# EAGLE design KMO_IO_MV1_3 (EAGLE 9.3.2)

## Sheet 1 of 2
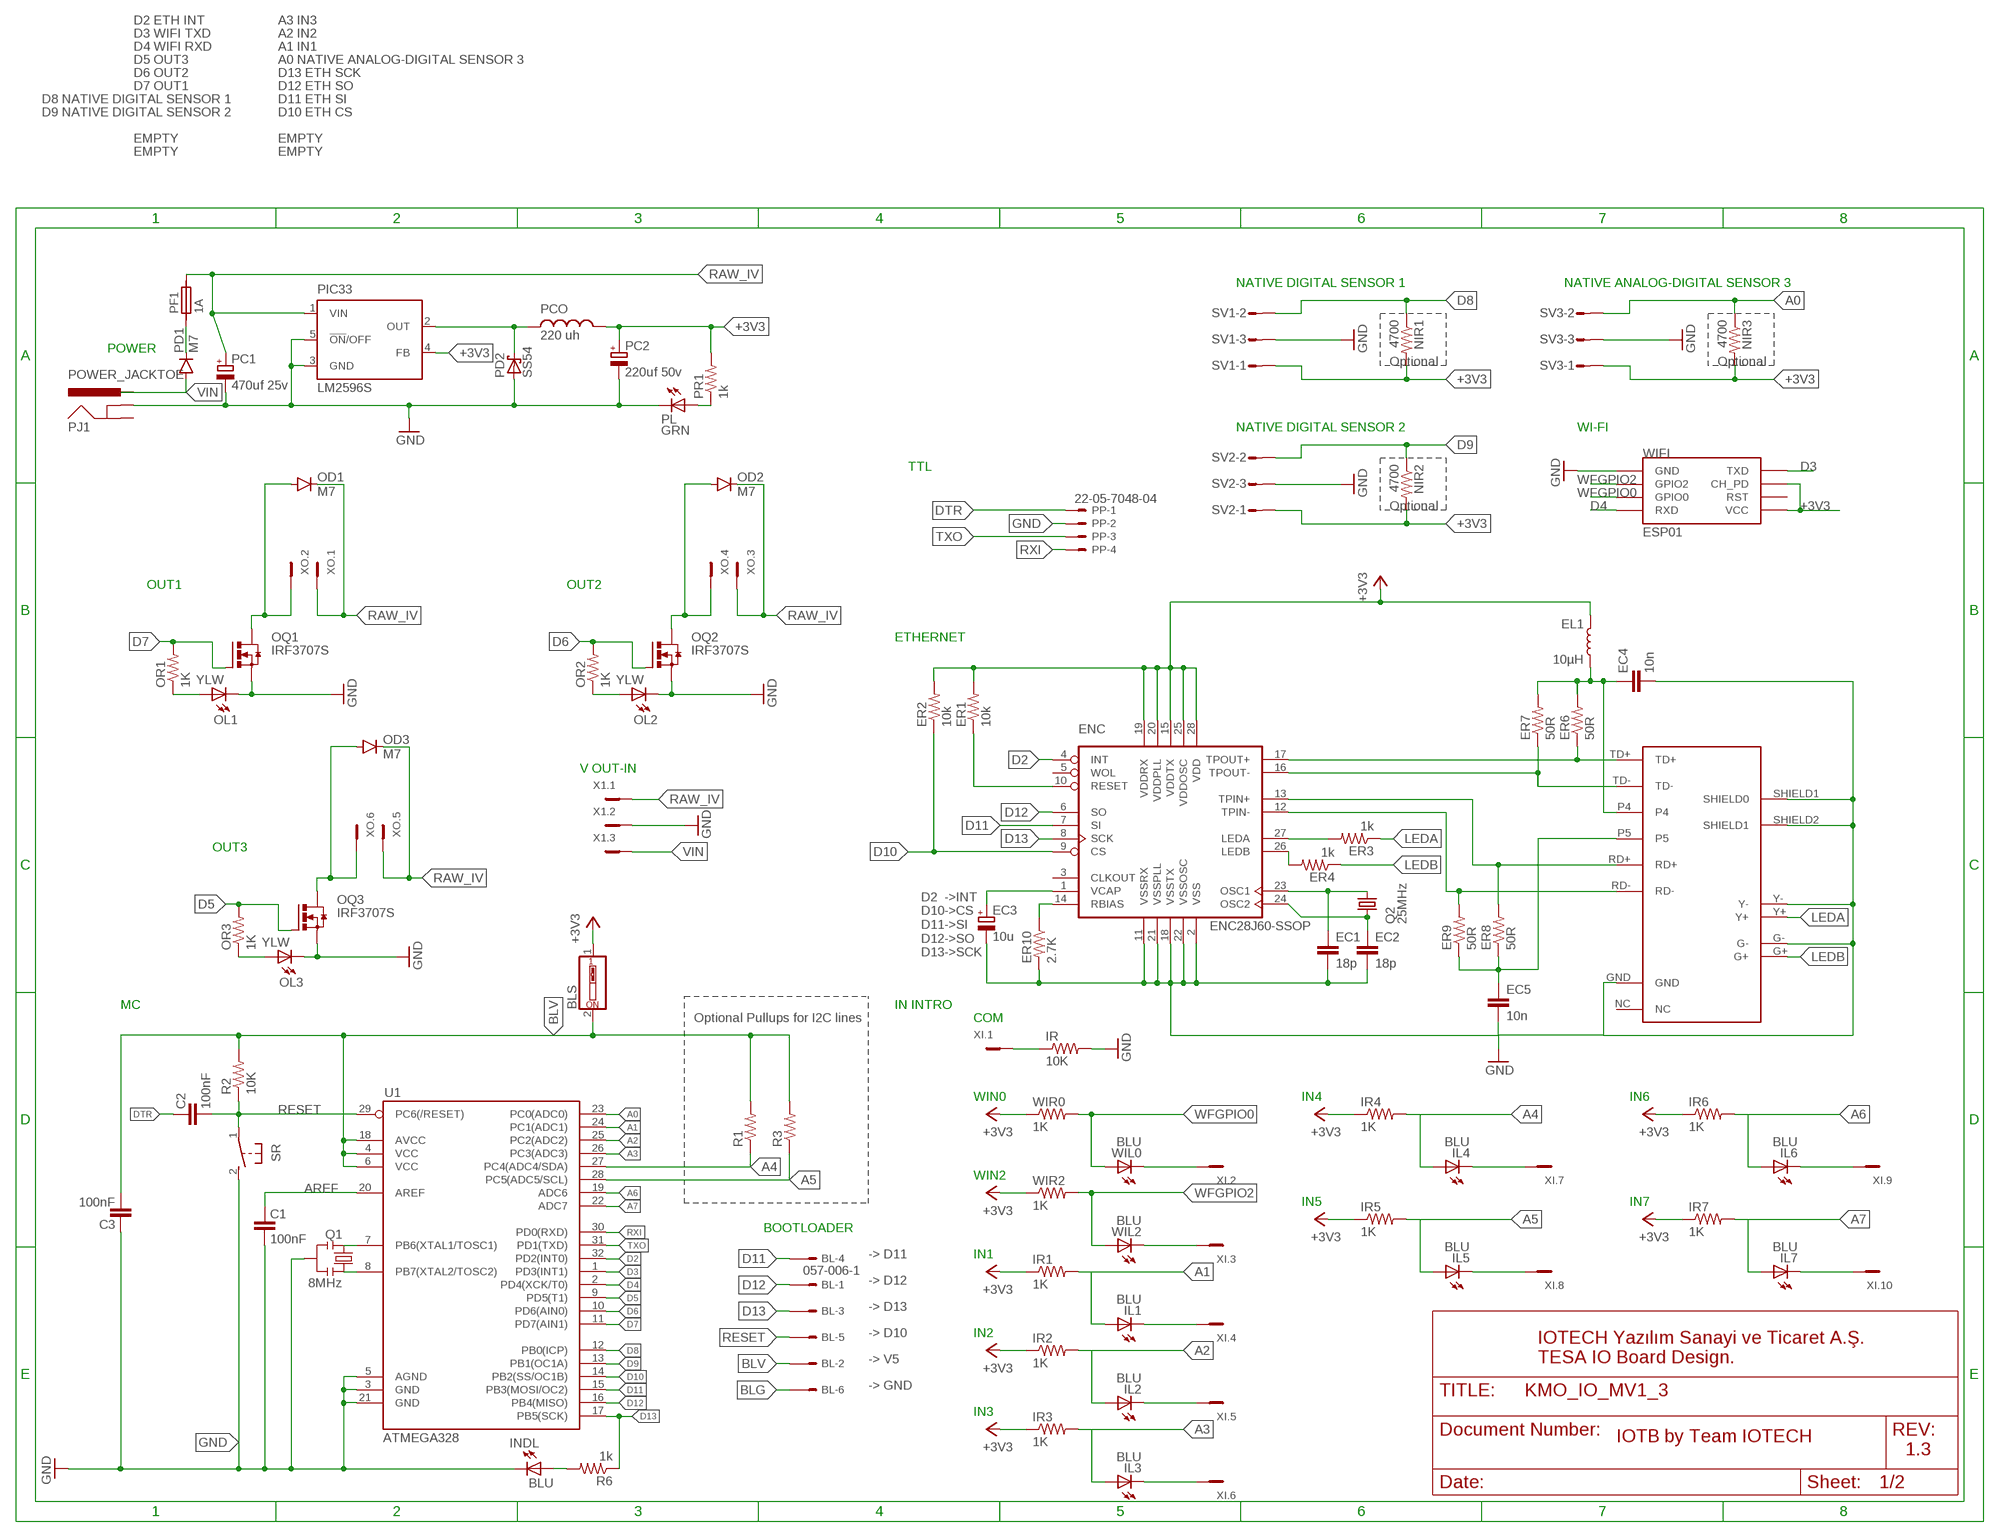
[diagram p0: schematic, sheet 1]

### Parts
BL  057-006-1  [057-006-1]
BLS  SW_DIP-1  [EDG-01]
C1  100nF  CAP0805  [0805]
C2  100nF  CAP0805  [0805]
C3  100nF  CAP0805  [0805]
EC1  18p  CAP0805  [0805]
EC2  18p  CAP0805  [0805]
EC3  10u  CPOL-EUCT3216  [CT3216]
EC4  10n  CAP0805  [0805]
EC5  10n  CAP0805  [0805]
EL1  10µH  INDUCTOR-0805-3.3UH  [0805]
ENC  ENC28J60-SSOP  [SSOP28]
ER1  10k  RESISTOR0805-RES  [0805]
ER2  10k  RESISTOR0805-RES  [0805]
ER3  1k  RESISTOR0805-RES  [0805]
ER4  1k  RESISTOR0805-RES  [0805]
ER6  50R  RESISTOR0805-RES  [0805]
ER7  50R  RESISTOR0805-RES  [0805]
ER8  50R  RESISTOR0805-RES  [0805]
ER9  50R  RESISTOR0805-RES  [0805]
ER10  2.7K  RESISTOR0805-RES  [0805]
IL1  BLU  LEDCHIP-LED0805  [CHIP-LED0805]
IL2  BLU  LEDCHIP-LED0805  [CHIP-LED0805]
IL3  BLU  LEDCHIP-LED0805  [CHIP-LED0805]
IL4  BLU  LEDCHIP-LED0805  [CHIP-LED0805]
IL5  BLU  LEDCHIP-LED0805  [CHIP-LED0805]
IL6  BLU  LEDCHIP-LED0805  [CHIP-LED0805]
IL7  BLU  LEDCHIP-LED0805  [CHIP-LED0805]
INDL  BLU  LEDCHIP-LED0805  [CHIP-LED0805]
IR  10K  RESISTOR0805-RES  [0805]
IR1  1K  RESISTOR0805-RES  [0805]
IR2  1K  RESISTOR0805-RES  [0805]
IR3  1K  RESISTOR0805-RES  [0805]
IR4  1K  RESISTOR0805-RES  [0805]
IR5  1K  RESISTOR0805-RES  [0805]
IR6  1K  RESISTOR0805-RES  [0805]
IR7  1K  RESISTOR0805-RES  [0805]
NIR1  4700  RESISTOR0805-RES  [0805]
NIR2  4700  RESISTOR0805-RES  [0805]
NIR3  4700  RESISTOR0805-RES  [0805]
OD1  M7  DIODESMA  [SMA-DIODE]
OD2  M7  DIODESMA  [SMA-DIODE]
OD3  M7  DIODESMA  [SMA-DIODE]
OL1  YLW  LEDCHIP-LED0805  [CHIP-LED0805]
OL2  YLW  LEDCHIP-LED0805  [CHIP-LED0805]
OL3  YLW  LEDCHIP-LED0805  [CHIP-LED0805]
OQ1  IRF3707S  IRF3704S  [D2PACK]
OQ2  IRF3707S  IRF3704S  [D2PACK]
OQ3  IRF3707S  IRF3704S  [D2PACK]
OR1  1K  RESISTOR0805-RES  [0805]
OR2  1K  RESISTOR0805-RES  [0805]
OR3  1K  RESISTOR0805-RES  [0805]
PC1  470uf 25v  CPOL-EU140CLH-1010  [140CLH-1010]
PC2  220uf 50v  CPOL-EU140CLH-1010  [140CLH-1010]
PCO  220 uh  MSS1260  [MSS1260]
PD1  M7  DIODESMA  [SMA-DIODE]
PD2  SS54  SCHOTTKY-DIODESMD  [SMB]
PF1  1A  SIBA194600  [1820]
PIC33  LM2596S  [TO263-5]
PJ1  POWER_JACKTOE  [POWER_JACK_SMD_OVERPASTE_TOE]
PL  GRN  LEDCHIP-LED0805  [CHIP-LED0805]
PP  22-05-7048-04  [7395-04]
PR1  1k  RESISTOR0805-RES  [0805]
Q1  8MHz  RESONATOR1:1  [RESONATOR-SMD-1:1]
Q2  25MHz  KX-9B  [5.0X3.2_2]
R1  RESISTOR0805-RES  [0805]
R2  10K  RESISTOR0805-RES  [0805]
R3  RESISTOR0805-RES  [0805]
R6  1k  RESISTOR0805-RES  [0805]
SR  31-XX  [B3F-31XX]
SV1  S03P  [S03P]
SV2  S03P  [S03P]
SV3  S03P  [S03P]
U1  ATMEGA328  ATMEGA168  [TQFP32-08]
U$2  HR911105A  [RJ45]
WIFI  ESP01  [ESP01]
WIL0  BLU  LEDCHIP-LED0805  [CHIP-LED0805]
WIL2  BLU  LEDCHIP-LED0805  [CHIP-LED0805]
WIR0  1K  RESISTOR0805-RES  [0805]
WIR2  1K  RESISTOR0805-RES  [0805]
X1  MC3  [MC3]
XI  MC10  [MC10]
XO  MC6  [MC6]

### Nets
+3V3: BLS.1 EL1.1 ENC.15(VDDTX) ENC.19(VDDRX) ENC.20(VDDPLL) ENC.25(VDDOSC) ENC.28(VDD) ER1.2 ER2.2 IR1.1 IR2.1 IR3.1 IR4.1 IR5.1 IR6.1 IR7.1 NIR1.2 NIR2.2 NIR3.2 PC2.+ PCO.P$1 PIC33.4(FB) PR1.2 SV1.1 SV2.1 SV3.1 WIFI.CH_PD WIFI.VCC WIR0.1 WIR2.1
A0: NIR3.1 SV3.2 U1.23(PC0(ADC0))
A1: IL1.A IR1.2 U1.24(PC1(ADC1))
A2: IL2.A IR2.2 U1.25(PC2(ADC2))
A3: IL3.A IR3.2 U1.26(PC3(ADC3))
A4: IL4.A IR4.2 R1.1 U1.27(PC4(ADC4/SDA))
A5: IL5.A IR5.2 R3.1 U1.28(PC5(ADC5/SCL))
A6: IL6.A IR6.2 U1.19(ADC6)
A7: IL7.A IR7.2 U1.22(ADC7)
AREF: C1.2 U1.20(AREF)
BLG: BL.6
BLV: BL.2 BLS.2 C3.1 R1.2 R2.2 R3.2 U1.4(VCC) U1.6(VCC) U1.18(AVCC)
D2: ENC.4(INT) U1.32(PD2(INT0))
D3: U1.1(PD3(INT1)) WIFI.TX(TXD)
D4: U1.2(PD4(XCK/T0)) WIFI.RX(RXD)
D5: OQ3.1(G) OR3.2 U1.9(PD5(T1))
D6: OQ2.1(G) OR2.2 U1.10(PD6(AIN0))
D7: OQ1.1(G) OR1.2 U1.11(PD7(AIN1))
D8: NIR1.1 SV1.2 U1.12(PB0(ICP))
D9: NIR2.1 SV2.2 U1.13(PB1(OC1A))
D10: ENC.9(CS) ER2.1 U1.14(PB2(SS/OC1B))
D11: BL.4 ENC.7(SI) U1.15(PB3(MOSI/OC2))
D12: BL.1 ENC.6(SO) U1.16(PB4(MISO))
D13: BL.3 ENC.8(SCK) R6.1 U1.17(PB5(SCK))
DTR: C2.2 PP.1
EP4: EC4.1 EL1.2 ER6.2 ER7.2 U$2.P4
EP5: EC5.1 ER8.1 ER9.1 U$2.P5
GND: C1.1 C3.2 EC1.2 EC2.2 EC3.- EC4.2 EC5.2 ENC.2(VSS) ENC.11(VSSRX) ENC.18(VSSTX) ENC.21(VSSPLL) ENC.22(VSSOSC) ER10.2 INDL.C IR.2 OL1.C OL2.C OL3.C OQ1.3(S) OQ2.3(S) OQ3.3(S) PC1.- PC2.- PD2.A PIC33.3(GND) PIC33.5(!ON!/OFF) PJ1.GND(GNDBREAK) PL.C PP.2 Q1.2 SR.2(S) SV1.3 SV2.3 SV3.3 U1.3(GND) U1.5(AGND) U1.21(GND) U$2.G- U$2.GND U$2.SHIELD1(SHIELD0) U$2.SHIELD2(SHIELD1) U$2.Y- WIFI.GND X1.2
LEDA: ER3.1 U$2.Y+
LEDB: ER4.1 U$2.G+
N$1: OD3.A OQ3.2(D) XO.6
N$2: PD1.C PF1.1
N$3: OD1.A OQ1.2(D) XO.2
N$4: OD2.A OQ2.2(D) XO.4
N$5: INDL.A R6.2
N$6: OL3.A OR3.1
N$7: OL2.A OR2.1
N$8: OL1.A OR1.1
N$9: ENC.27(LEDA) ER3.2
N$10: Q1.3 U1.8(PB7(XTAL2/TOSC2))
N$11: PL.A PR1.1
N$12: IL1.C XI.4
N$13: EC3.+ ENC.1(VCAP)
N$14: ENC.26(LEDB) ER4.2
N$15: Q1.1 U1.7(PB6(XTAL1/TOSC1))
N$16: PCO.P$2 PD2.C PIC33.2(OUT)
N$17: ENC.10(RESET) ER1.1
N$18: WIL2.C XI.3
N$19: ENC.14(RBIAS) ER10.1
N$20: IL2.C XI.5
N$21: IL3.C XI.6
N$22: EC2.1 ENC.24(OSC2) Q2.1
N$23: IL4.C XI.7
N$24: EC1.1 ENC.23(OSC1) Q2.2
N$25: IL5.C XI.8
N$26: IL6.C XI.9
N$27: IL7.C XI.10
N$28: WIL0.C XI.2
N$29: IR.1 XI.1
RAW_IV [vcc]: OD1.C OD2.C OD3.C PC1.+ PF1.2 PIC33.1(VIN) X1.1 XO.1 XO.3 XO.5
RD+: ENC.13(TPIN+) ER8.2 U$2.RD+
RD-: ENC.12(TPIN-) ER9.2 U$2.RD-
RESET: BL.5 C2.1 R2.1 SR.1(P) U1.29(PC6(/RESET))
RXI: PP.4 U1.30(PD0(RXD))
TD+: ENC.17(TPOUT+) ER6.1 U$2.TD+
TD-: ENC.16(TPOUT-) ER7.1 U$2.TD-
TXO: PP.3 U1.31(PD1(TXD))
VIN: PD1.A PJ1.VIN0(PWR) X1.3
WFGPIO0: WIFI.GPIO0 WIL0.A WIR0.2
WFGPIO2: WIFI.GPIO2 WIL2.A WIR2.2
Unconnected: ENC.3(CLKOUT) ENC.5(WOL) PJ1.P$4(GND) U$2.NC WIFI.RST

### Notes on the sheet
- D2 ETH INT | A3 IN3
- D3 WIFI TXD | A2 IN2
- D4 WIFI RXD | A1 IN1
- D5 OUT3 | A0 NATIVE ANALOG-DIGITAL SENSOR 3
- D6 OUT2 | D13 ETH SCK
- D7 OUT1 | D12 ETH SO
- D8 NATIVE DIGITAL SENSOR 1 | D11 ETH SI
- D9 NATIVE DIGITAL SENSOR 2 | D10 ETH CS
- EMPTY | EMPTY
- EMPTY | EMPTY
- NATIVE DIGITAL SENSOR 1 | NATIVE ANALOG-DIGITAL SENSOR 3
- POWER
- Optional | Optional
- NATIVE DIGITAL SENSOR 2 | WI-FI
- TTL
- Optional
- OUT1 | OUT2
- ETHERNET
- V OUT-IN
- OUT3
- D2  ->INT
  D10->CS
  D11->SI
  D12->SO
  D13->SCK
- MC | IN INTRO
- Optional Pullups for I2C lines | COM
- WIN0 | IN4 | IN6
- WIN2
- IN5 | IN7
- BOOTLOADER
- -> D11 | IN1
- -> D12
- -> D13
- -> D10 | IN2
- -> V5
- IOTECH Yazılım Sanayi ve Ticaret A.Ş.
  TESA IO Board Design.
- -> GND
- IN3
- IOTB by Team IOTECH
- 1.3

## Sheet 2 of 2
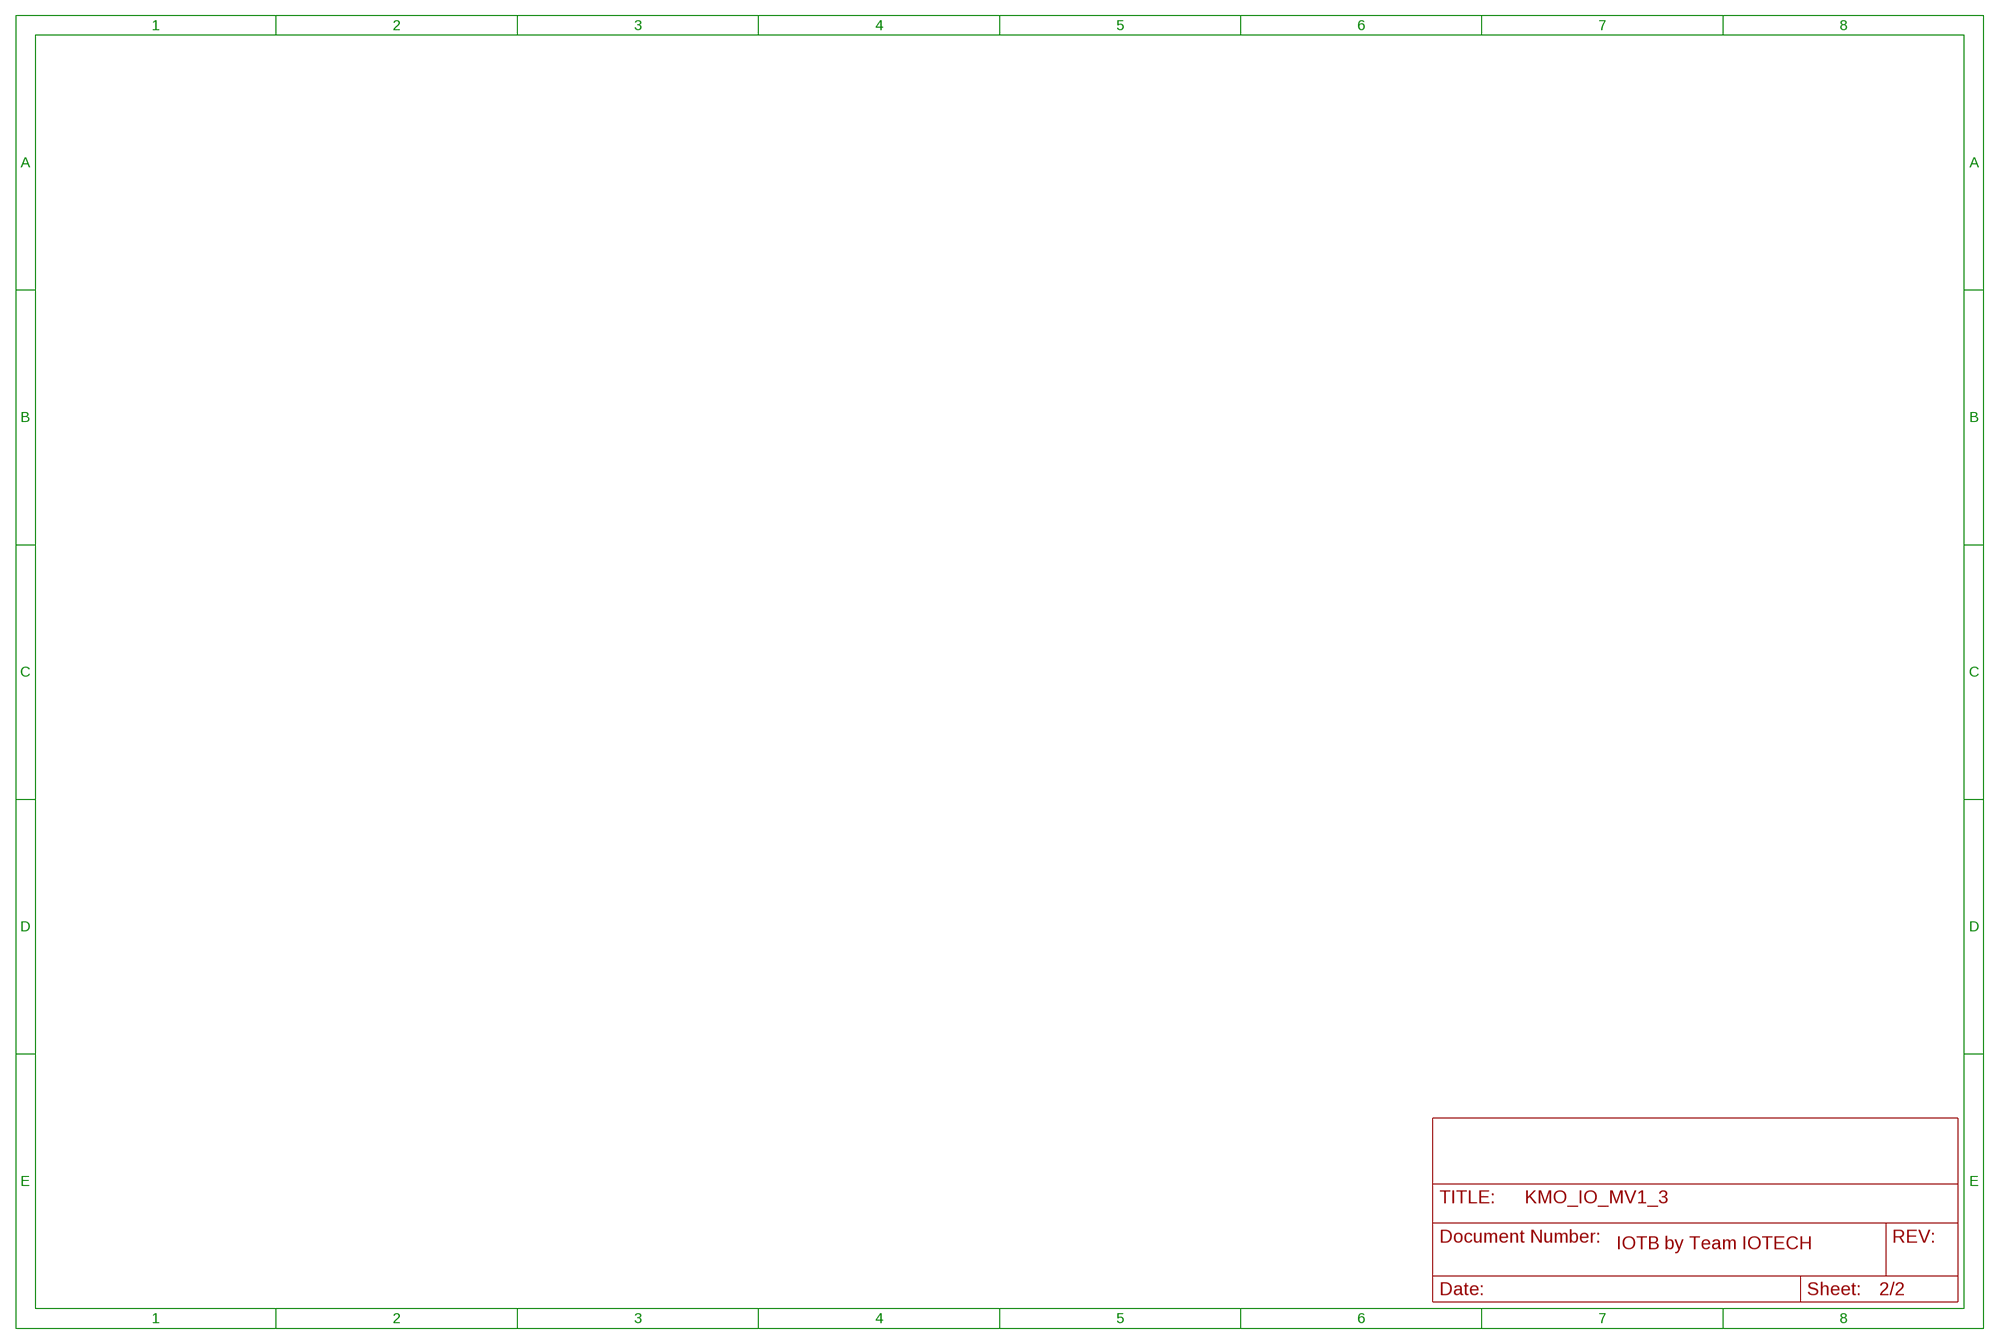
[diagram p1: schematic, sheet 2]

### Notes on the sheet
- IOTB by Team IOTECH

## Library data of the parts
BL = con-panduit:057-006-: CONNECTOR 6-pin series 057 contact pc board low profile headers; OC_FARNELL: unknown; OC_NEWARK: unknown
BLS = special:SW_DIP-1: DIP SWITCH
C1-C3 EC1 EC2 EC4 EC5 = SparkFun-Passives:CAP: Capacitor Standard 0603 ceramic capacitor, and 0.1" leaded capacitor.
EC3 PC1 PC2 = rcl:CPOL-EU: POLARIZED CAPACITOR, European symbol; SPICEPREFIX: C
EL1 = SparkFun-Coils:INDUCTOR: Inductors Resist changes in electrical current. Basically a coil of wire. SparkFun Products: SparkFun Load Cell Amplifier - HX711 <https://www.sparkfun.com/products/13879> IOIO-OTG - V2.2 <https://www.sparkfun.com/products/13613>; PROD_ID: NDUC-13076; VALUE: 3.3µH/±20%/450mA
ENC = microchip-enc28j60:ENC28J60-*: Microchip 10Mbit Eth. contoller with SPI interface
ER1-ER4 ER6-ER10 IR IR1-IR7 NIR1-NIR3 OR1-OR3 PR1 R1-R3 R6 WIR0 WIR2 = SparkFun-Passives:RESISTOR: Resistor Basic schematic elements and footprints for 0603, 1206, and PTH resistors.
IL1-IL7 INDL OL1-OL3 PL WIL0 WIL2 = led:LED: LED OSRAM: - CHIPLED LG R971, LG N971, LY N971, LG Q971, LY Q971, LO R971, LY R971 LH N974, LH R974 LS Q976, LO Q976, LY Q976 LO Q996 - Hyper CHIPLED LW Q18S LB Q993, LB Q99A, LB R99A - SideLED LS A670, LO A670, LY A670, LG A670, LP A670 LB A673, LV A673, LT A673, LW A673 LH A674 LY A675 LS A676, LA A676, LO A676, LY A676, LW A676 LS A679, LY A679, LG A679 - Hyper Micro SIDELED® LS Y876, LA Y876, LO Y876, LY Y876 LT Y87S - SmartLED LW L88C, LW L88S LB L89C, LB L89S, LG L890 LS L89K, LO L89K, LY L89K LS L896, LA L896, LO L896, LY L896 - TOPLED LS T670, LO T670, LY T670, LG T670, LP T670 LSG T670, LSP T670, LSY T670, LOP T670, LYG T670 LG T671, LOG T671, LSG T671 LB T673, LV T673, LT T673, LW T673 LH T674 LS T676, LA T676, LO T676, LY T676, LB T676, LH T676, LSB T676, LW T676 LB T67C, LV T67C, LT T67C, LS T67K, LO T67K, LY T67K, LW E67C LS E67B, LA E67B, LO E67B, LY E67B, LB E67C, LV E67C, LT E67C LW T67C LS T679, LY T679, LG T679 LS T770, LO T770, LY T770, LG T770, LP T770 LB T773, LV T773, LT T773, LW T773 LH T774 LS E675, LA E675, LY E675, LS T675 LS T776, LA T776, LO T776, LY T776, LB T776 LHGB T686 LT T68C, LB T68C - Hyper Mini TOPLED® LB M676 - Mini TOPLED Santana® LG M470 LS M47K, LO M47K, LY M47K Source: http://www.osram.convergy.de LUXEON: - LUMILED® LXK2-PW12-R00, LXK2-PW12-S00, LXK2-PW14-U00, LXK2-PW14-V00 LXK2-PM12-R00, LXK2-PM12-S00, LXK2-PM14-U00 LXK2-PE12-Q00, LXK2-PE12-R00, LXK2-PE12-S00, LXK2-PE14-T00, LXK2-PE14-U00 LXK2-PB12-K00, LXK2-PB12-L00, LXK2-PB12-M00, LXK2-PB14-N00, LXK2-PB14-P00, LXK2-PB14-Q00 LXK2-PR12-L00, LXK2-PR12-M00, LXK2-PR14-Q00, LXK2-PR14-R00 LXK2-PD12-Q00, LXK2-PD12-R00, LXK2-PD12-S00 LXK2-PH12-R00, LXK2-PH12-S00 LXK2-PL12-P00, LXK2-PL12-Q00, LXK2-PL12-R00 Source: www.luxeon.com KINGBRIGHT: KA-3528ASYC Source: www.kingbright.com
OD1-OD3 PD1 = SparkFun-DiscreteSemi:DIODE: Diode These are standard reverse protection diodes and small signal diodes. SMA package can handle up to about 1A. SOD-323 can handle about 200mA. What the SOD-323 package when ordering, there are some mfgs out there that are 5-pin packages.
OQ1-OQ3 = transistor-power:IRF3704: SMPS MOSFET HEXFET® Power MOSFET Source: http://www.irf.com/product-info/datasheets/data/irf3704.pdf
PCO = inductor-coilcraft:MSS1260: SMT Power Inductor
PD2 = diode:SCHOTTKY-DIODE: Schottky Diode
PF1 = _hhn_PtcFuses_Siba_r500_Ozan:SIBA194600*: SIBA PTC-Fuses, Series 194600, 1812 (4.5 3.2)mm Source: www.siba.de/ Package: SMD 1812 (4.5 x 3.2)mm Technologies: SIBA194600Axxx xxx: Trip-Current * 10 mA Author: Dipl.-Ing. FH Rainer Bayer
PIC33 = national-semiconductor:LM2596: SIMPLE SWITCHER® Power Converter 150 kHz 3A Step-Down Voltage Regulator Source: http://www.national.com/ds/LM/LM2596.pdf; MF: NATIONAL SEMICONDUCTOR; MPN: LM2596S-ADJ/NOPB; OC_FARNELL: 9494367; OC_NEWARK: 41K3842
PJ1 = SparkFun-Connectors:POWER_JACK: Power Jack Connector This is the standard 5.5mm barrel jack for power. The PTH is the most common, proven, reliable, footprint. The Slot footprint only works if the mill layer is transmitted to the PCB fab house so be warned. Here are the connectors we sell at SparkFun: DC Barrel Power Jack/Connector <https://www.sparkfun.com/products/119> (PRT-00119) DC Barrel Power Jack/Connector (SMD) <https://www.sparkfun.com/products/12748> (PRT-12748) DC Barrel Jack Adapter - Breadboard Compatible <https://www.sparkfun.com/products/10811> (PRT-10811) It is used on this SparkFun product (and many, many others): SparkFun RedBoard - Programmed with Arduino <https://www.sparkfun.com/products/12757> (DEV-12757) Also, if you need a mating power supply or connector, please check these out: Wall Adapter Power Supply - 9VDC 650mA <https://www.sparkfun.com/products/298> (TOL-00298) DC Barrel Jack Adapter - Male <https://www.sparkfun.com/products/10287> (PRT-10287); PROD_ID: CONN-08106; SF_ID: PRT-12748
PP = con-molex:22-?-04: CONNECTOR wire to board 2.54 mm (.1 inch) pitch header; MF: MOLEX; OC_FARNELL: unknown; OC_NEWARK: unknown
Q1 = Testing:RESONATOR: Resonator Small SMD resonator. This is the itty bitty 10/20MHz resonators with built in caps. CSTCE10M0G55 and CSTCE20M0V53. Footprint for SMD has been used in SFE production for years, and does work okay. 1:1 is an attempt to get larger fillets on the sides so it will be easier to inspect these solders in our AOI machine. The pads have been minimized to match the actual metal under the resonator. To see this relation, it includes an image import of the bottom side of the component. Imported to scale on layer 200.
Q2 = crystal-geyer_V1_0:KX: Quartz Crystals (MHz) SMD: KX - Serie Model Size l/w/h [mm] Frequency Range Frequency Stability Temp. Range [°C] Load Capacitance AECQ 200 availabel Datasheet KX-4 KX-5 KX-6 KX-7 KX-9A KX-9B KX-12A KX-12B KX-13 KX-20 KX-K KX-KS 1.6/1.2/0.3 2.0/1.6/0.45 2.5/2.0/0.55 3.2/2.5/0.8 5.0/3.2/1.0 5.0/3.2/1.1 6.0/3.5/1.1 6.0/3.5/1.0 7.0/5.0 /1.3 11.6/5.5/1.6 12.3/4.5/4.2 12.3/4.5/3.2 24.0 ~ 80.0 MHz 16.0 ~ 80.0 MHz 12.0 ~ 80.0 MHz 8.0 ~ 60.0 MHz 7,68 ~ 300,0 MHz 8,0 ~ 50,0 MHz 8,0 ~ 150,0 MHz 8,0 ~ 50,0 MHz 6,0 ~ 160,0 MHz 3,579 ~ 25,0 MHz 3,579 ~ 70,0 MHz 3,579 ~ 70,0 MHz ±10 … ±50ppm ±10 … ±50ppm ±10 … ±50ppm ±10 … ±50ppm ±10 … ±50ppm ±10 … ±50ppm ±10 … ±50ppm ±10 … ±50ppm ±10 … ±50ppm ±50ppm ±10 … ±50ppm ±10 … ±50ppm (*) -40°C …+85°C (*) -40°C …+125°C (*) -40°C …+125°C (*) -40°C …+125°C (*) -40°C …+105°C (*) -40°C …+105°C (*) -40°C …+125°C (*) -40°C …+105°C (*) -40°C …+105°C (*) -40°C …+105°C (*) -40°C …+85°C (*) -40°C …+85°C 8, 8…16 8, 8…16 10, 8…16 12, 7…20 16, 10…20 16, 10…20 16, 10…20 16, 12…20 16, 12…20 16, 12…20 16, 12…30 16, 12…30 - yes yes yes - - - - - - - - KX-4.pdf <http://www.geyer-electronic.de/uploads/tx_userartikelfrequenz/GEYER-KX-4.pdf> KX-5.pdf <http://www.geyer-electronic.de/uploads/tx_userartikelfrequenz/GEYER-KX-5.pdf> KX-6.pdf <http://www.geyer-electronic.de/uploads/tx_userartikelfrequenz/GEYER-KX-6.pdf> KX-7.pdf <http://www.geyer-electronic.de/uploads/tx_userartikelfrequenz/GEYER-KX-7.pdf> KX-9A.pdf <http://www.geyer-electronic.de/uploads/tx_userartikelfrequenz/GEYER-KX-9A.pdf> KX-9B.pdf <http://www.geyer-electronic.de/uploads/tx_userartikelfrequenz/GEYER-KX-9B.pdf> KX-12A.pdf <http://www.geyer-electronic.de/uploads/tx_userartikelfrequenz/GEYER-KX-12A.pdf> KX-12B.pdf <http://www.geyer-electronic.de/uploads/tx_userartikelfrequenz/GEYER-KX-12B.pdf> KX-13.pdf <http://www.geyer-electronic.de/uploads/tx_userartikelfrequenz/GEYER-KX-13.pdf> KX-20.pdf <http://www.geyer-electronic.de/uploads/tx_userartikelfrequenz/GEYER-KX-20.pdf> KX-K.pdf <http://www.geyer-electronic.de/uploads/tx_userartikelfrequenz/GEYER-KX-K.pdf> KX-KS.pdf <http://www.geyer-electronic.de/uploads/tx_userartikelfrequenz/GEYER-KX-KS.pdf> <http://www.geyer-electronic.de/fileadmin/template/img/logo-geyer-electronic.png> Details see: http://www.geyer-electronic.de/Frequenz-Produkte.9.0.html Created 2016-06-07, Hans Locher 2016 (C) Geyer Quartz Technology KX4,KX5,KX6,KX7,KX9A,KX9B,KX12A,KX12B,KX13,KX20,KXK,KXKS;1612;2016;2520;3225;5032;6035;7050;11655;12345;1,6x1,2;2,0x1,6;2,5x2,0;3,2x2,5;5,0x3,2;6,0x3,5;7,0x5,0;11,6x5,5;12,3x4,5;12,3x4,5;1.6x1.2;2.0x1.6;2.5x2.0;3.2x2.5;5.0x3.2;6.0x3.5;7.0x5.0;11.6x5.5;12.3x4.5;12.3x4.5;
SR = switch-omron:31-XX: OMRON SWITCH; MPN: B3F-3100; OC_FARNELL: 959704; OC_NEWARK: 36M3582
SV1-SV3 = con_io_sxp:S03P: AMP MT CONNECTOR
U1 = SparkFun:ATMEGA168
U$2 = HR911105A:HR911105A
WIFI = esp8266modules:ESP01: ESP8266 Wifi module 01
X1 = con-phoenix-381_l:MC3: Mini-Combicon 3.81mm horizontal 3-polig (ohne Gegenstecker)
XI = con-phoenix-381_l:MC10: Mini-Combicon 3.81mm horizontal 10-polig (ohne Gegenstecker)
XO = con-phoenix-381_l:MC6: Mini-Combicon 3.81mm horizontal 6-polig (ohne Gegenstecker)

## Net classes
0 default: width 0.203 mm, drill 0.3 mm, clearance 0.16 mm
1 vcc: width 0.254 mm, drill 0.3 mm, clearance 0.16 mm

## Board
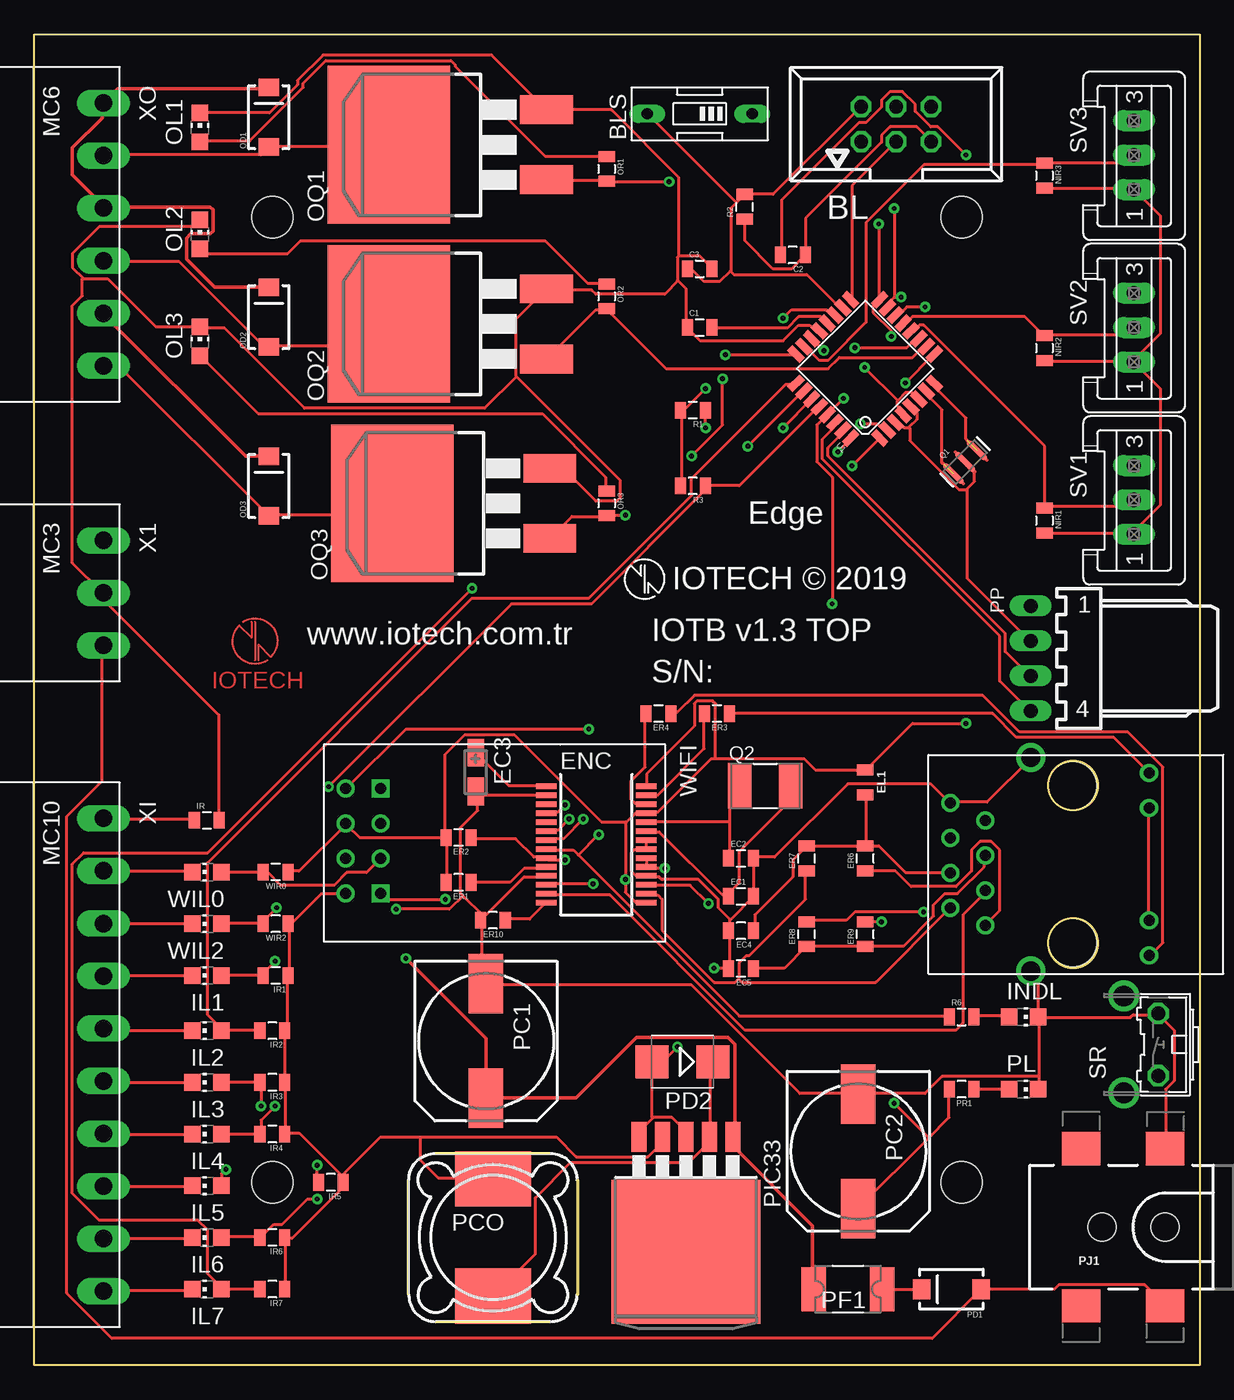
[diagram p2: board, top side]
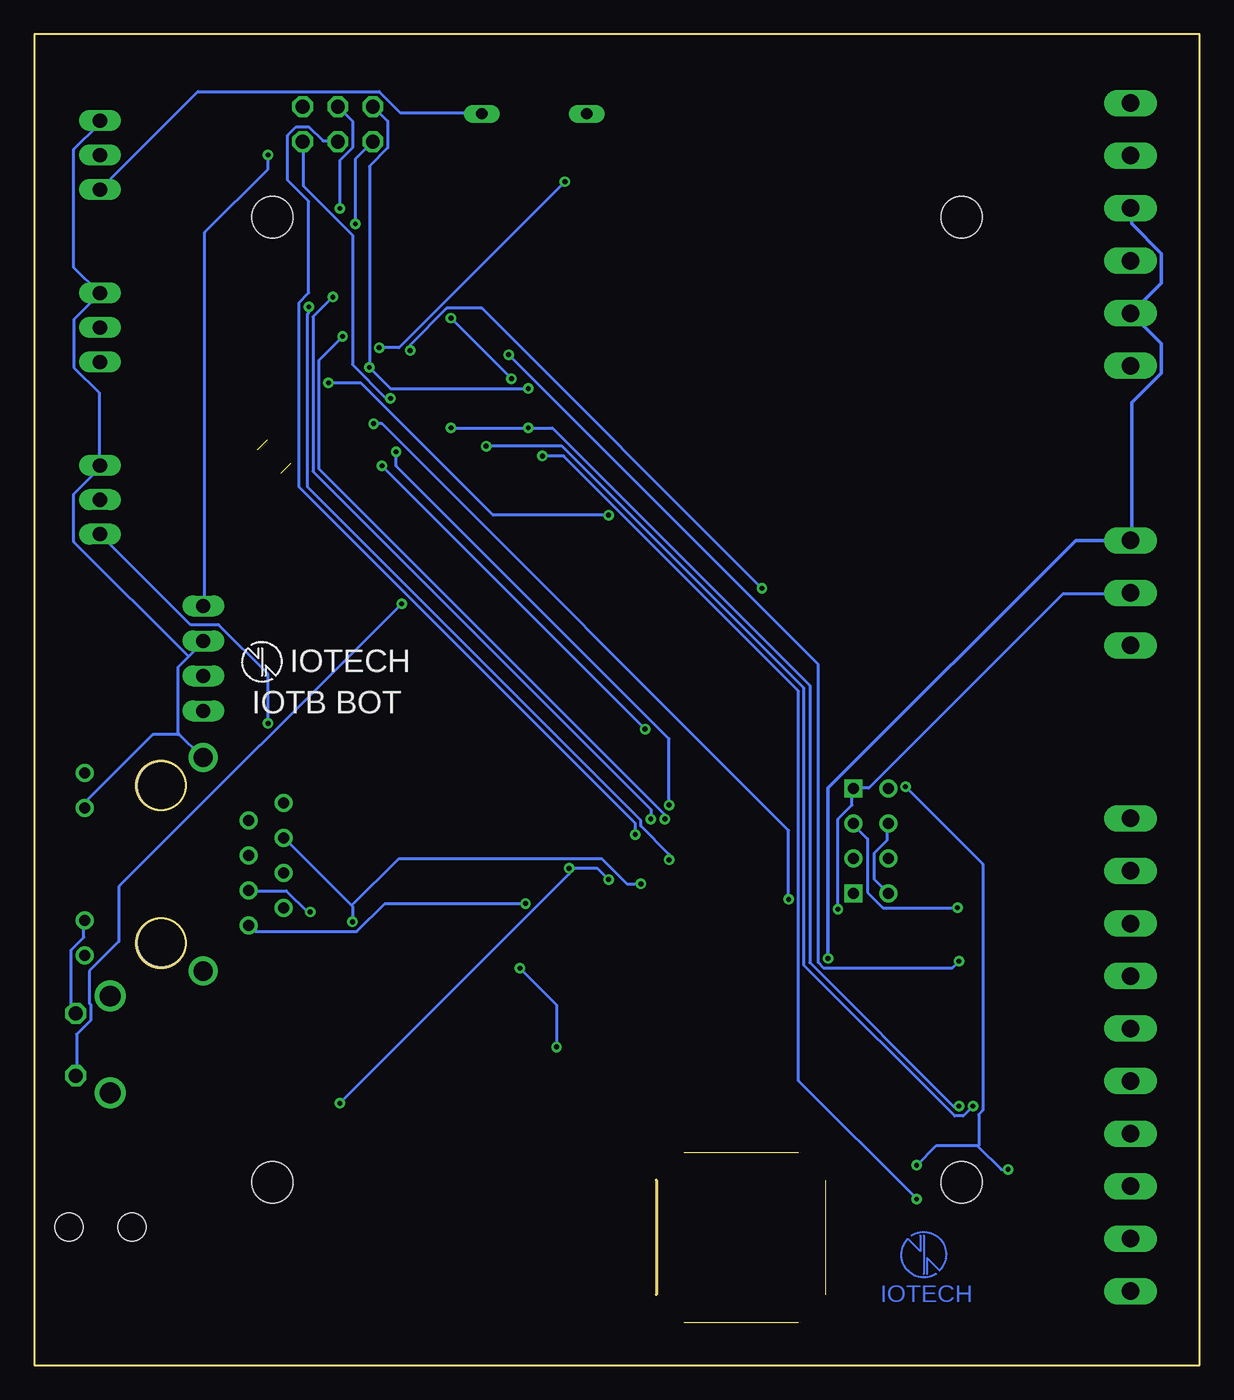
[diagram p3: board, bottom side, seen from below]

Size 84.5 x 96.5 mm. Coordinates in mm from the lower left corner, seen from the top.
Outline: 0,0 0,96.5 84.5,96.5 84.5,0 0,0
Copper layers (1*16): Top 0.035mm / dielectric 1.5mm / Bottom 0.035mm
Design rules "KMO_IO_M": minimum track width 6mil, minimum drill 0.35mm, track to track 0.205mm, track to pad 0.205mm, pad to pad 0.205mm, via to via 0.205mm, smd to smd 6mil, copper to edge 40mil, drill to drill 6mil, minimum pad ring 10mil, minimum via ring 8mil, stop-mask expansion 4mil, vias tented up to drill 0mil, thermal gap 10mil
Holes 3 mm at 17.25,83.25 67.25,83.25 17.25,13.25 67.25,13.25

### Footprints (pad centres in the part's own frame; a part is rotated, then mirrored left to right if it is on the bottom)
057-006-1 = drill 1 octagon: 1 -2.54,-1.27; 2 -2.54,1.27; 3 0,-1.27; 4 0,1.27; 5 2.54,-1.27; 6 2.54,1.27
EDG-01 = drill 0.813 long: 1 0,-3.81; 2 0,3.81
0805 = smd 0.8 x 1.2: 1 -0.9,0; 2 0.9,0
CT3216 = smd 2 x 1.2: + -1.4,0; - 1.4,0
SSOP28 = smd 0.4 x 1.5: 1 -4.225,-3.625; 2 -3.575,-3.625; 3 -2.925,-3.625; 4 -2.275,-3.625; 5 -1.625,-3.625; 6 -0.975,-3.625; 7 -0.325,-3.625; 8 0.325,-3.625; 9 0.975,-3.625; 10 1.625,-3.625; 11 2.275,-3.625; 12 2.925,-3.625; 13 3.575,-3.625; 14 4.225,-3.625; 15 4.225,3.625; 16 3.575,3.625; 17 2.925,3.625; 18 2.275,3.625; 19 1.625,3.625; 20 0.975,3.625; 21 0.325,3.625; 22 -0.325,3.625; 23 -0.975,3.625; 24 -1.625,3.625; 25 -2.275,3.625; 26 -2.925,3.625; 27 -3.575,3.625; 28 -4.225,3.625
CHIP-LED0805 = smd 1.2 x 1.2: A 0,-1.05; C 0,1.05
SMA-DIODE = smd 1.27 x 1.47: A -2.15,0; C 2.15,0
D2PACK = smd 2.083 x 3.81: 1 -2.54,-8.89; 3 2.54,-8.89 | smd 11.43 x 8.89: 2 0,2.54
140CLH-1010 = smd 4.3 x 2.5: + 4.15,0; - -4.15,0
MSS1260 = smd 5.5 x 4: P$1 0,4.25; P$2 0,-4.25
SMB = smd 2.4 x 2.4: A 2.2,0; C -2.2,0
1820 = smd 1.78 x 3.2: 1 -2.49,0; 2 2.49,0
TO263-5 = smd 1.067 x 2.159: 1 -3.404,-5.791; 2 -1.702,-5.791; 3 0,-5.791; 4 1.702,-5.791; 5 3.404,-5.791 | smd 10.8 x 10.41: 6 0,2.54
POWER_JACK_SMD_OVERPASTE_TOE = smd 2.8 x 2.4: GND 0,-5.7; P$4 6.1,-5.7; VIN0 0,5.7; VIN1 6.1,5.7 | hole 2.032: 0,0; 4.572,0
7395-04 = drill 1.016 long: 1 3.81,0; 2 1.27,0; 3 -1.27,0; 4 -3.81,0
RESONATOR-SMD-1:1 = smd 0.45 x 1.905: 1 -1.2,0; 2 0,0; 3 1.2,0
5.0X3.2_2 = smd 1.7 x 3.3: 1 -1.85,0; 2 1.85,0
B3F-31XX = drill 1.016 octagon: 1 -2.261,-1.245; 2 2.261,-1.245 | drill 1.499 pad 2.159: 3 -3.505,1.245; 4 3.505,1.245
S03P = drill 1.016 long: 1 2.5,0; 2 0,0; 3 -2.5,0
TQFP32-08 = smd 1.27 x 0.559: 1 -4.293,2.8; 2 -4.293,2; 3 -4.293,1.2; 4 -4.293,0.4; 5 -4.293,-0.4; 6 -4.293,-1.2; 7 -4.293,-2; 8 -4.293,-2.8; 17 4.293,-2.8; 18 4.293,-2; 19 4.293,-1.2; 20 4.293,-0.4; 21 4.293,0.4; 22 4.293,1.2; 23 4.293,2; 24 4.293,2.8 | smd 0.559 x 1.27: 9 -2.8,-4.293; 10 -2,-4.293; 11 -1.2,-4.293; 12 -0.4,-4.293; 13 0.4,-4.293; 14 1.2,-4.293; 15 2,-4.293; 16 2.8,-4.293; 25 2.8,4.293; 26 2,4.293; 27 1.2,4.293; 28 0.4,4.293; 29 -0.4,4.293; 30 -1.2,4.293; 31 -2,4.293; 32 -2.8,4.293
RJ45 = drill 0.8: G+ 5.84,-6.305; G- 5.84,-3.765; GND -8.57,4.76; NC -6.03,3.5; P4 -8.57,-0.32; P5 -6.03,0.96; RD+ -6.03,-1.58; RD- -8.57,2.22; TD+ -6.03,-4.12; TD- -8.57,-2.86; Y+ 5.84,6.945; Y- 5.84,4.405 | drill 1.4: SHIELD1 -2.73,-7.425; SHIELD2 -2.73,8.065 | hole 3.5: 0.3,-5.38; 0.3,6.02
ESP01 = drill 0.8: CH_PD -1.285,-8.178; GPIO0 1.255,-5.638; GPIO2 -1.285,-5.638; RST 1.255,-8.178; TX -3.825,-8.178; VCC 3.795,-8.178 | drill 0.8 square: GND -3.825,-5.638; RX 3.795,-5.638
MC3 = drill 1.27 long: 1 -3.81,0; 2 0,0; 3 3.81,0
MC10 = drill 1.27 long: 1 -17.145,0; 2 -13.335,0; 3 -9.525,0; 4 -5.715,0; 5 -1.905,0; 6 1.905,0; 7 5.715,0; 8 9.525,0; 9 13.335,0; 10 17.145,0
MC6 = drill 1.27 long: 1 -9.525,0; 2 -5.715,0; 3 -1.905,0; 4 1.905,0; 5 5.715,0; 6 9.525,0

### Placement (x,y rotation side)
BL  62.5,90 0 top
BLS  48.25,90.75 90 top
C1  48.25,75.25 0 top
C2  55,80.5 180 top
C3  48.25,79.5 0 top
EC1  51.25,34 0 top
EC2  51.25,36.75 0 top
EC3  32,43 270 top
EC4  51.25,31.5 180 top
EC5  51.25,28.75 180 top
EL1  60.25,42.25 270 top
ENC  40.75,37.75 270 top
ER1  30.75,35 180 top
ER2  30.75,38.25 180 top
ER3  49.5,47.25 180 top
ER4  45.25,47.25 180 top
ER6  60.25,36.75 90 top
ER7  56,36.75 90 top
ER8  56,31.25 90 top
ER9  60.25,31.25 90 top
ER10  33.25,32.25 180 top
IL1  12.5,28.25 90 top
IL2  12.5,24.25 90 top
IL3  12.5,20.5 90 top
IL4  12.5,16.75 90 top
IL5  12.5,13 90 top
IL6  12.5,9.25 90 top
IL7  12.5,5.5 90 top
INDL  71.75,25.25 270 top
IR  12.5,39.5 0 top
IR1  17.5,28.25 180 top
IR2  17.25,24.25 180 top
IR3  17.25,20.5 180 top
IR4  17.25,16.75 180 top
IR5  21.5,13.25 180 top
IR6  17.25,9.25 180 top
IR7  17.25,5.5 180 top
NIR1  73.25,61.25 270 top
NIR2  73.25,73.75 270 top
NIR3  73.25,86.25 270 top
OD1  17,90.5 90 top
OD2  17,76 90 top
OD3  17,63.75 90 top
OL1  12,89.75 0 top
OL2  12,82 0 top
OL3  12,74.25 0 top
OQ1  28.25,88.5 90 top
OQ2  28.25,75.5 90 top
OQ3  28.5,62.5 90 top
OR1  41.5,86.75 270 top
OR2  41.5,77.5 270 top
OR3  41.5,62.5 270 top
PC1  32.75,23.5 270 top
PC2  59.75,15.5 270 top
PCO  33.25,9.25 0 top
PD1  66.5,5.5 180 top
PD2  47,22 180 top
PF1  59,5.5 180 top
PIC33  47.25,10.75 180 top
PJ1  82,10 180 top
PL  71.75,20 270 top
PP  72.25,51.25 90 top
PR1  67.25,20 180 top
Q1  67.5,65.5 45 top
Q2  53,42 0 top
R1  47.75,69.25 180 top
R2  51.5,84 90 top
R3  47.75,63.75 180 top
R6  67.25,25.25 0 top
SR  80.25,23.25 90 top
SV1  79.75,62.75 270 top
SV2  79.75,75.25 270 top
SV3  79.75,87.75 270 top
U1  60.25,72.25 135 top
U$1  [IOTECH_COPPER_W_TEXT]  16,52.5 0 top
U$2  75,36 0 top
U$4  [IOTECH_COPPER_W_TEXT]  20,8 0 bottom
WIFI  30.75,38 270 top
WIL0  12.5,35.75 90 top
WIL2  12.5,32 90 top
WIR0  17.5,35.75 180 top
WIR2  17.5,32 180 top
X1  5,56 270 top
XI  5,22.5 270 top
XO  5,82 270 top

### Tracks (layer width: path | path; a pad name or v marks a point on that pad's centre or on a via)
+3V3  (via drill 0.35)
  Top 0.203: NIR1.2 73.27,60.31 79.7,60.31 SV1.1 79.7,60.41 81.64,62.35 81.64,70.82 79.8,72.66 SV2.1 | NIR2.2 73.27,72.76 79.7,72.76 SV2.1 | NIR3.2 73.27,85.31 79.7,85.31 SV3.1 79.8,85.21 81.64,83.38 81.64,74.8 79.7,72.86 SV2.1 | 64.85,16.48 59.8,11.43 PC2.+ | 64.85,16.48 66.33,17.96 66.33,19.9 PR1.2 | ENC.20 44.39,36.74 44.39,36.13 ENC.19 44.39,36.02 v45.72,36.02 | 49.39,43.98 49.09,43.98 45.21,40.11 44.39,40.11 ENC.25 44.29,40 43.58,40 42.91,39.34 | 49.39,43.98 55.82,43.98 56.64,43.17 60.21,43.17 EL1.1 60.31,43.17 63.68,46.53 v67.56,46.53 | 42.91,39.34 42.86,39.29 v42.86,35.21 42.86,34.29 43.58,33.57 44.29,33.57 ENC.15 | 49.39,43.98 49.39,47.96 49.19,48.17 48.07,48.17 47.86,47.96 47.86,46.33 44.39,42.86 44.39,42.05 ENC.28 | v62.35,18.98 64.85,16.48 | ER1.2 29.9,35 29.9,38.17 ER2.2 | WIR0.1 18.47,35.82 19.18,35.82 22.55,39.19 WIFI.CH_PD 22.66,39.19 23.57,38.27 29.8,38.27 ER2.2 | IR7.1 18.16,5.51 18.16,9.18 IR6.1 18.27,9.18 18.68,9.18 22.35,12.86 22.35,13.16 IR5.1 | IR5.1 22.35,13.27 22.35,13.68 19.18,16.84 18.27,16.84 IR4.1 18.16,16.84 18.16,20.41 IR3.1 18.16,20.51 18.16,24.19 IR2.1 18.16,24.29 18.37,24.49 18.37,28.17 IR1.1 18.47,28.27 18.47,31.94 WIR2.1 18.57,31.94 20.82,34.19 22.55,34.19 WIFI.VCC | 27.96,16.53 25.1,16.53 22.35,13.78 IR5.1 | 27.96,16.53 37.86,16.53 39.29,15.1 44.49,15.1 45.51,16.12 45.51,16.53 PIC33.4 | 27.96,16.53 27.96,14.9 29.29,13.57 33.17,13.57 PCO.P$1 | 42.91,39.34 42.86,39.39 41.13,39.39 34.8,45.72 31.23,45.72 29.8,44.29 29.8,38.37 ER2.2
  Bottom 0.203: BLS.1 52.15,90.83 57.96,90.83 59.49,92.36 72.66,92.36 79.7,85.31 SV3.1 | v42.86,35.21 43.68,36.02 v45.72,36.02 45.72,35.62 v62.35,18.98 | WIFI.CH_PD 22.66,39.19 22.66,38.06 23.57,37.15 23.57,35.21 22.66,34.29 WIFI.VCC | v67.56,46.53 67.56,50.11 71.13,53.68 73.17,53.68 79.7,60.21 SV1.1
A0
  Top 0.203: SV3.2 79.7,87.66 79.19,87.15 73.27,87.15 NIR3.1 73.17,87.05 64.5,87.05 60.31,82.86 60.31,75.62 57.56,72.86 56.94,72.86 56.02,73.78 55.82,73.78 U1.23
A1  (via drill 0.35)
  Top 0.203: IL1.A 13.57,28.27 16.53,28.27 IR1.2 16.53,28.37 v17.45,29.29 | v50.11,73.27 55.21,73.27 U1.24
  Bottom 0.203: v50.11,73.27 27.66,50.82 27.66,29.19 27.25,28.78 17.96,28.78 v17.45,29.29
A2
  Top 0.203: IR2.2 16.33,24.29 13.57,24.29 IL2.A 13.57,24.39 12.55,25.41 12.55,36.43 31.74,55.62 40.21,55.62 47.66,63.07 47.66,64.29 54.49,71.13 55.21,71.13 U1.25
A3  (via drill 0.35)
  Top 0.203: IL3.A 13.57,20.51 16.33,20.51 IR3.2 16.43,20.41 v16.43,18.78 | v51.74,66.64 55.72,70.62 U1.26
  Bottom 0.203: v51.74,66.64 46.23,66.64 28.68,49.09 28.68,28.98 17.76,18.06 17.14,18.06 v16.43,18.78
A4  (via drill 0.35)
  Top 0.203: IL4.A 13.57,16.74 16.33,16.74 IR4.2 16.43,16.84 16.43,17.76 v17.45,18.78 | v48.68,67.97 48.68,69.19 R1.1 | v54.29,67.97 56.33,70.01 U1.27
  Bottom 0.203: v54.29,67.97 v48.68,67.97 46.94,67.97 28.27,49.29 28.27,29.19 17.86,18.78 v17.45,18.78
A5  (via drill 0.35)
  Top 0.203: v13.88,14.19 13.57,13.88 13.57,13.06 IL5.A | v20.51,14.49 20.51,13.27 IR5.2 | U1.28 56.84,69.5 51.13,63.78 48.68,63.78 R3.1 48.58,63.68 48.58,63.37 40.41,55.21 34.59,55.21 v21.33,41.94
  Bottom 0.203: v13.88,14.19 14.39,14.19 16.07,15.87 | 16.07,15.87 16.12,15.92 19.08,15.92 v20.51,14.49 | v21.33,41.94 15.72,36.33 15.72,18.47 16.02,18.16 16.02,15.92 16.07,15.87
A6  (via drill 0.35)
  Top 0.203: IL6.A 13.57,9.29 16.33,9.29 IR6.2 16.43,9.29 17.35,10.21 17.96,10.21 19.8,12.04 v20.51,12.04 | v54.29,75.92 54.9,76.54 57.45,76.54 57.76,76.23 57.96,76.23 U1.19 | v49.9,71.54 49.9,68.17 v47.66,65.92
  Bottom 0.203: v49.9,71.54 v54.29,75.92 | v47.66,65.92 46.13,65.92 29.08,48.88 29.08,20.61 v20.51,12.04
A7  (via drill 0.35)
  Top 0.203: IR7.2 16.33,5.51 13.57,5.51 IL7.A 13.57,5.61 12.55,6.63 12.55,9.8 11.84,10.51 4.69,10.51 2.75,12.45 2.75,36.33 3.57,37.15 12.55,37.15 v31.74,56.33 | v57.25,73.58 56.43,74.39 U1.22
  Bottom 0.203: v57.25,73.58 57.25,73.99 54.6,76.64 52.05,76.64 v31.74,56.33
AREF
  Top 0.203: C1.2 49.19,75.21 54.6,75.21 55.41,76.03 57.05,76.03 57.45,75.62 U1.20
BLV  (via drill 0.35)
  Top 0.203: 50.46,79.34 50.52,79.39 50.52,83.89 50.92,84.29 | 50.46,79.34 49.7,78.58 48.58,78.58 47.66,79.5 C3.1 | 50.92,84.29 51.43,84.8 R2.2 51.53,84.91 53.58,84.91 59.9,91.23 BL.2 | 50.46,79.34 50.72,79.09 56.02,79.09 58.37,76.74 58.58,76.74 U1.18 | 50.92,84.29 44.49,90.72 BLS.2 | R3.2 46.94,63.78 46.94,69.19 R1.2 47.05,69.19 v48.68,70.82 | 62.61,69.95 63.17,70.52 63.68,70.52 64.09,70.11 U1.6 | 62.61,69.95 62.56,69.9 62.56,69.6 62.97,69.19 62.97,68.99 U1.4 | v60.21,72.35 62.61,69.95
  Bottom 0.203: BL.2 59.9,91.23 58.88,90.21 58.88,88.27 60.21,86.95 v60.21,72.35 58.68,70.82 v48.68,70.82
D2  (via drill 0.35)
  Top 0.203: v58.27,66.23 59.19,67.15 U1.32 | v38.47,40.62 37.96,40.11 37.15,40.11 ENC.4
  Bottom 0.203: v58.27,66.23 58.27,65.21 38.47,45.41 v38.47,40.62
D3  (via drill 0.35)
  Top 0.203: v59.29,65.21 61.23,67.15 U1.1 | v40.21,46.13 26.94,46.13 22.66,41.84 WIFI.TX
  Bottom 0.203: v40.21,46.13 v59.29,65.21
D4  (via drill 0.35)
  Top 0.203: v59.9,68.27 61.13,68.27 61.54,67.86 61.84,67.86 U1.2 | v29.8,33.78 25.61,33.78 25.21,34.19 WIFI.RX
  Bottom 0.203: v59.9,68.27 59.29,68.27 29.8,38.78 v29.8,33.78
D5  (via drill 0.35)
  Top 0.203: OQ3.1 37.45,60.01 38.98,61.54 41.43,61.54 OR3.2 41.53,61.64 v42.86,61.64 | v63.17,71.23 65.21,73.27 U1.9
  Bottom 0.203: v63.17,71.23 60.82,71.23 51.23,61.64 v42.86,61.64
D6
  Top 0.203: OQ2.1 40.72,76.54 41.43,76.54 OR2.2 41.53,76.54 45.82,72.25 57.56,72.25 58.37,73.07 63.68,73.07 64.39,73.78 64.6,73.78 U1.10
D7  (via drill 0.35)
  Top 0.203: OQ1.1 37.15,85.93 41.43,85.93 OR1.2 41.53,85.82 v46.02,85.82 | v59.49,73.78 63.27,73.78 63.88,74.39 64.09,74.39 U1.11
  Bottom 0.203: v59.49,73.78 58.07,73.78 v46.02,85.82
D8
  Top 0.203: SV1.2 79.7,62.66 79.29,62.25 73.27,62.25 NIR1.1 73.27,62.35 73.27,66.64 64.5,75.42 64.19,75.42 63.78,75.01 U1.12
D9
  Top 0.203: SV2.2 79.7,75.21 79.19,74.7 73.27,74.7 NIR2.1 73.17,74.7 71.84,76.03 63.68,76.03 63.27,75.62 63.07,75.62 U1.13
D10  (via drill 0.35)
  Top 0.203: ER2.1 31.74,38.17 34.9,38.17 36.23,36.84 37.04,36.84 ENC.9 37.15,36.74 37.25,36.64 v38.47,36.64 | v64.6,76.74 63.27,76.74 62.76,76.23 62.45,76.23 U1.14
  Bottom 0.203: v64.6,76.74 64.6,76.33 64.7,76.23 64.7,63.68 40.51,39.49 40.51,39.09 38.47,37.04 v38.47,36.64
D11  (via drill 0.35)
  Top 0.203: 62.35,77.46 61.94,77.05 61.94,76.74 U1.15 | v62.35,83.89 62.35,77.46 | v39.8,39.59 38.37,38.17 37.15,38.17 ENC.7 | 62.35,77.46 v62.86,77.46
  Bottom 0.203: v62.35,83.89 62.35,87.36 61.43,88.27 61.43,90.21 62.45,91.23 BL.4 | v39.8,39.59 39.8,40.31 64.29,64.8 64.29,76.03 v62.86,77.46
D12  (via drill 0.35)
  Top 0.203: v61.23,82.76 61.23,77.35 U1.16 61.23,77.25 60.82,76.84 60.82,76.33 62.15,75.01 v62.15,74.6 | v38.78,39.59 37.96,38.78 37.15,38.78 ENC.6
  Bottom 0.203: v61.23,82.76 61.23,87.46 60.01,88.68 BL.1 | v38.78,39.59 38.78,39.9 63.88,65.01 63.88,72.86 v62.15,74.6
D13  (via drill 0.35)
  Top 0.203: U1.17 59.29,77.35 59.29,85.52 62.45,88.68 BL.3 | 39.44,36.99 39.09,37.35 37.15,37.35 ENC.8 | 39.44,36.99 51.13,25.31 66.33,25.31 R6.1 | 39.44,36.99 v40.92,38.47
  Bottom 0.203: v40.92,38.47 40.92,39.29 65.31,63.68 65.31,77.05 64.6,77.76 64.6,84.39 66.13,85.93 66.13,89.19 65.52,89.8 64.6,89.8 63.58,88.78 62.56,88.78 BL.3
DTR  (via drill 0.35)
  Top 0.203: v67.56,87.76 65.52,89.8 65.01,89.8 63.88,90.93 63.88,91.44 62.97,92.36 62.05,92.36 61.43,91.74 61.43,91.23 60.31,90.11 59.8,90.11 54.19,84.5 54.19,80.52 C2.2
  Bottom 0.203: v67.56,87.76 67.56,86.74 72.15,82.15 72.15,55.11 PP.1
EP4
  Top 0.203: ER6.2 60.31,37.66 60.31,41.33 EL1.2 | EC4.1 52.25,31.53 52.25,32.66 55.01,35.41 55.01,36.64 55.92,37.55 ER7.2 56.02,37.66 60.21,37.66 ER6.2 | U$2.P4 66.33,35.72 63.17,35.72 61.23,37.66 60.41,37.66 ER6.2
EP5
  Top 0.203: EC5.1 52.25,28.78 54.39,28.78 55.92,30.31 ER8.1 56.02,30.41 60.21,30.41 ER9.1 60.31,30.41 63.07,30.41 65.21,32.55 65.21,33.37 66.03,34.19 66.94,34.19 68.88,36.13 68.88,36.94 U$2.P5
GND  (via drill 0.35)
  Top 0.203: 3.52,78.83 2.75,79.6 2.75,80.62 4.69,82.56 11.53,82.56 11.94,82.97 OL2.C | 3.52,78.83 3.57,78.78 5.31,78.78 8.78,75.31 11.94,75.31 OL3.C 12.04,75.21 13.78,75.21 19.59,69.39 32.66,69.39 34.95,71.69 | IR.2 13.37,39.59 13.37,47.15 5,55.52 5,55.92 X1.2 4.9,56.02 2.75,58.17 2.75,76.84 3.47,77.56 3.47,78.78 3.52,78.83 | OL1.C 12.04,90.83 17.04,90.83 19.08,92.86 19.08,93.17 20.92,95.01 33.17,95.01 37.04,91.13 OQ1.3 37.15,91.03 41.84,91.03 46.74,86.13 46.74,80.42 | 46.69,78.63 46.64,78.68 46.64,80.31 46.74,80.42 | 46.69,78.63 47.25,78.07 47.25,75.31 C1.1 47.35,75.21 48.27,74.29 54.29,74.29 55.41,75.42 56.23,75.42 56.64,75.01 56.84,75.01 U1.21 | 46.74,80.42 48.27,80.42 49.09,79.6 C3.2 | 46.69,78.63 45.72,77.66 40.72,77.66 40.41,77.97 37.15,77.97 OQ2.3 37.04,77.97 34.9,75.82 34.9,71.74 34.95,71.69 | 34.95,71.69 42.45,64.19 42.45,62.86 42.25,62.66 40.72,62.66 38.37,65.01 37.45,65.01 OQ3.3 | U$2.Y- 80.82,40.31 80.82,32.25 U$2.G- | PJ1.GND 82.05,15.72 82.05,20 82.66,20.61 82.66,24.29 81.54,25.41 SR.2 81.44,25.41 79.7,25.41 79.5,25.21 72.97,25.21 INDL.C | ENC.2 37.04,41.33 32.25,41.33 32.04,41.53 EC3.- 32.15,41.33 32.15,40.21 30.92,38.98 30.92,34.19 31.07,34.03 | ER10.2 32.45,32.25 32.45,27.86 32.66,27.66 PC1.- 32.76,27.55 47.66,27.55 55.52,19.7 59.7,19.7 PC2.- 59.8,19.7 64.6,19.7 65.82,20.92 72.86,20.92 | ENC.11 37.04,35.41 35.51,35.41 32.45,32.35 ER10.2 | 31.07,34.03 32.55,32.55 ER10.2 | 72.86,20.92 72.86,25.21 INDL.C | 72.86,20.92 72.86,20 PL.C | INDL.C 72.76,25.31 72.76,28.17 72.35,28.57 U$2.SHIELD1 | 44.85,17.91 44.9,17.96 46.23,17.96 47.25,16.94 47.25,16.63 PIC33.3
  Top 0.203: 44.85,17.91 43.88,16.94 43.88,16.63 PIC33.5 | 44.85,17.91 44.8,17.96 44.8,21.94 PD2.A 44.9,22.04 45.62,22.04 v46.64,23.06 | ENC.22 44.39,38.06 44.39,37.45 ENC.21 44.29,37.35 43.47,37.35 43.27,37.15 43.27,35.82 43.58,35.51 44.29,35.51 ENC.18 44.39,35.41 45.31,35.41 45.51,35.21 48.17,35.21 49.6,33.78 49.6,33.17 50.46,32.3 | 50.46,32.3 52.15,33.98 EC1.2 52.15,34.09 52.15,36.74 EC2.2 52.25,36.84 53.68,36.84 58.98,42.15 65.01,42.15 66.33,40.82 U$2.GND 66.44,40.82 69.09,40.82 72.25,43.98 U$2.SHIELD2 | 50.46,32.3 50.41,32.25 50.41,31.53 EC4.2 50.41,31.43 50.41,28.78 EC5.2 50.31,28.78 v49.29,28.78 | 63.42,68.02 63.98,68.58 63.98,69.09 U1.5 | 63.42,68.02 63.37,67.97 63.07,67.97 62.76,68.27 62.45,68.27 U1.3 | 67.61,63.53 67.56,63.48 67.05,63.48 63.48,67.05 63.48,67.97 63.42,68.02 | 67.61,63.53 68.17,64.09 68.17,64.7 Q1.2 | 67.61,63.53 67.66,63.48 67.66,57.05 72.15,52.56 PP.2 | v26.23,33.06 30.11,33.06 31.07,34.03
  Bottom 0.203: X1.2 5,55.92 9.9,55.92 23.98,41.84 WIFI.GND 25.21,41.74 25.21,40.62 26.23,39.59 v26.23,33.06 | U$2.G- 80.93,32.15 80.93,31.02 81.84,30.11 81.84,25.82 81.54,25.51 SR.2 | v46.64,23.06 46.64,26.12 v49.29,28.78 | SV3.3 79.8,90.21 79.8,90.01 81.64,88.17 81.64,79.6 79.8,77.76 SV2.3 79.8,77.66 81.64,75.82 81.64,72.35 79.8,70.52 79.8,65.31 SV1.3 79.8,65.21 79.8,65.01 81.64,63.17 81.64,59.7 73.32,51.38 | 73.32,51.38 74.09,50.62 74.09,45.82 74.04,45.77 | 73.32,51.38 72.25,52.45 PP.2 | 74.04,45.77 72.35,44.09 U$2.SHIELD2 | U$2.Y- 80.82,40.41 80.82,40.82 75.92,45.72 74.09,45.72 74.04,45.77
LEDA
  Top 0.203: ER3.1 50.41,47.25 69.5,47.25 71.23,45.51 78.27,45.51 80.82,42.96 U$2.Y+
LEDB
  Top 0.203: ER4.1 46.23,47.35 46.64,47.35 47.86,48.58 68.78,48.58 71.44,45.92 79.29,45.92 81.84,43.37 81.84,30.61 80.93,29.7 U$2.G+
N$1
  Top 0.203: OQ3.2 25.92,62.45 25.1,61.64 17.04,61.64 OD3.A 16.94,61.64 6.12,72.46 5,72.46 XO.6
N$2
  Top 0.203: PD1.C 64.29,5.51 61.54,5.51 PF1.1
N$3
  Top 0.203: OQ1.2 25.61,88.48 25.51,88.38 17.04,88.38 OD1.A 16.94,88.27 16.43,87.76 5,87.76 XO.2
N$4
  Top 0.203: OQ2.2 25.61,75.42 24.08,73.88 17.04,73.88 OD2.A 16.94,73.88 16.63,73.88 10.51,80.01 5,80.01 XO.4
N$5
  Top 0.203: R6.2 68.17,25.31 70.62,25.31 INDL.A
N$6
  Top 0.203: OR3.1 41.43,63.48 41.43,64.39 36.84,68.99 16.23,68.99 12.04,73.17 OL3.A
N$7
  Top 0.203: OR2.1 41.43,78.48 40.11,78.48 37.04,81.54 19.29,81.54 18.37,80.62 12.35,80.62 12.04,80.93 OL2.A
N$8
  Top 0.203: OR1.1 41.43,87.66 37.04,87.66 30.51,94.19 30.51,94.29 30.21,94.6 21.12,94.6 19.49,92.97 19.49,92.66 15.61,88.78 12.04,88.78 OL1.A
N$9
  Top 0.203: ER3.2 48.58,47.25 48.58,44.7 45.21,41.33 44.39,41.33 ENC.27
N$10  (1 unrouted)
  Top 0.203: U1.8 65.31,71.13 65.31,70.92 67.56,68.68 67.56,67.15 67.63,67.07
N$11
  Top 0.203: PR1.1 68.17,20 70.62,20 PL.A
N$12
  Top 0.203: IL1.C 11.43,28.27 5,28.27 XI.4
N$13
  Top 0.203: ENC.1 37.04,42.05 34.39,42.05 32.04,44.39 EC3.+
N$14
  Top 0.203: ER4.2 44.29,47.25 44.29,43.37 43.27,42.35 43.27,41.02 43.58,40.72 44.29,40.72 ENC.26
N$15  (1 unrouted)
  Top 0.203: U1.7 64.7,70.62 64.7,70.42 65.82,69.29 65.82,65.41 65.93,65.37
N$16
  Top 0.203: PD2.C 49.19,21.94 48.98,21.74 48.98,16.63 PIC33.2 48.88,16.53 48.88,16.12 47.45,14.7 38.88,14.7 36.33,12.14 36.33,8.06 33.27,5 PCO.P$2
N$17
  Top 0.203: ER1.1 31.74,35 34.49,35 35.51,36.02 37.04,36.02 ENC.10
N$18
  Top 0.203: WIL2.C 11.43,32.04 5,32.04 XI.3
N$19
  Top 0.203: ER10.1 34.19,32.35 35.92,32.35 37.04,33.47 ENC.14
N$20
  Top 0.203: IL2.C 11.43,24.29 5.1,24.29 5,24.39 XI.5
N$21
  Top 0.203: IL3.C 11.43,20.51 5,20.51 XI.6
N$22
  Top 0.203: 50.41,39.39 50.41,41.23 51.13,41.94 Q2.1 | 50.41,39.39 50.41,36.84 EC2.1 | 50.41,39.39 44.39,39.39 ENC.24
N$23
  Top 0.203: IL4.C 11.43,16.74 5,16.74 XI.7
N$24
  Top 0.203: ENC.23 44.39,38.68 45.31,38.68 49.9,34.09 50.31,34.09 EC1.1 50.31,34.19 51.13,35 51.13,37.25 54.8,40.92 54.8,41.94 Q2.2
N$25
  Top 0.203: IL5.C 11.43,12.96 XI.8
N$26
  Top 0.203: IL6.C 11.43,9.18 5,9.18 XI.9
N$27
  Top 0.203: IL7.C 11.43,5.41 5,5.41 XI.10
N$28
  Top 0.203: WIL0.C 11.43,35.82 5,35.82 XI.2
N$29
  Top 0.203: IR.1 11.53,39.59 5,39.59 XI.1
RAW_IV  (via drill 0.35)
  Top 0.254: PF1.2 56.43,5.51 56.43,10.1 50.72,15.82 50.72,16.53 PIC33.1 50.82,16.53 50.82,23.27 50.31,23.78 43.68,23.78 39.29,19.39 32.76,19.39 PC1.+ 32.76,19.49 32.76,23.68 v26.94,29.49 | OD1.C 16.94,92.56 6.02,92.56 XO.1 4.9,91.44 4.9,90.42 2.75,88.27 2.75,86.33 5,84.09 XO.3 5,83.99 12.76,83.99 12.96,83.78 12.96,82.25 12.76,82.05 11.33,82.05 11.02,81.74 11.02,80.21 13.06,78.17 16.94,78.17 OD2.C | OD3.C 16.94,65.92 15.31,65.92 5,76.23 XO.5
  Bottom 0.254: XO.3 4.9,83.89 4.9,82.76 2.75,80.62 2.75,78.48 4.9,76.33 XO.5 4.9,76.23 2.75,74.09 2.75,71.94 4.9,69.8 4.9,59.9 X1.1 5.1,59.8 8.98,59.8 26.94,41.84 v26.94,29.49
RD+  (via drill 0.35)
  Top 0.203: v64.5,32.86 59.49,32.86 58.88,32.25 56.02,32.25 ER8.2 | ENC.13 37.15,34.09 41.74,34.09 51.53,24.29 66.84,24.29 67.35,24.8 67.35,32.66 68.88,34.19 68.88,34.39 U$2.RD+
  Bottom 0.203: v64.5,32.86 64.7,32.86 66.23,34.39 68.88,34.39 U$2.RD+
RD-  (via drill 0.35)
  Top 0.203: v61.43,32.15 60.31,32.15 ER9.2 | v40.51,34.9 37.15,34.9 ENC.12
  Bottom 0.203: v61.43,32.15 61.43,33.27 61.48,33.32 | 61.48,33.32 66.33,38.17 U$2.RD- | v40.51,34.9 41.53,34.9 43.37,36.74 58.07,36.74 61.48,33.32
RESET  (via drill 0.35)
  Top 0.203: R2.1 51.53,83.07 51.53,81.54 53.58,79.5 54.9,79.5 55.82,80.42 C2.1 55.92,80.52 55.92,83.17 61.43,88.68 61.43,89.19 62.05,89.8 63.98,89.8 65.01,88.78 BL.5 | v58.68,70.11 57.56,68.99 U1.29 57.45,68.88 56.74,68.17 56.74,65.52 57.86,64.39 v57.86,55.21
  Bottom 0.203: v58.68,70.11 58.98,70.11 61.43,72.56 61.43,81.95 65.01,85.52 65.01,88.68 BL.5 | v57.86,55.21 78.37,34.7 78.37,30.72 80.52,28.57 80.52,26.23 80.42,26.12 80.42,25 81.44,23.98 81.44,21.02 SR.1
RXI
  Top 0.203: U1.30 57.96,68.27 57.96,67.97 57.15,67.15 57.15,65.72 70.01,52.86 70.01,49.6 72.15,47.45 PP.4
TD+  (via drill 0.35)
  Top 0.203: ER6.1 60.31,35.82 62.45,35.82 63.58,34.7 66.84,34.7 67.97,35.82 67.97,37.35 68.58,37.96 69.39,37.96 70.01,37.35 70.01,32.96 68.99,31.94 U$2.TD+ | v48.88,33.47 47.55,34.8 44.39,34.8 ENC.17
  Bottom 0.203: v48.88,33.47 59.09,33.47 61.13,31.43 68.48,31.43 68.88,31.84 U$2.TD+
TD-
  Top 0.203: 51.08,28.01 50.82,27.76 49.29,27.76 45.51,31.53 45.51,33.78 45.21,34.09 44.39,34.09 ENC.16 | 51.08,28.01 51.13,28.06 51.13,29.19 51.64,29.7 51.84,29.7 55.92,33.78 55.92,35.82 ER7.1 | 51.08,28.01 51.33,27.76 61.03,27.76 66.33,33.06 U$2.TD-
TXO
  Top 0.203: U1.31 58.58,67.76 58.58,67.56 57.56,66.54 57.56,65.92 70.42,53.07 70.42,51.74 72.15,50.01 PP.3
VIN
  Top 0.203: PJ1.VIN0 81.95,4.39 80.52,5.82 74.29,5.82 73.99,5.51 68.68,5.51 PD1.A 68.58,5.41 65.11,1.94 5.61,1.94 2.35,5.21 2.35,39.8 4.9,42.35 4.9,52.15 X1.3
WFGPIO0
  Top 0.203: WIL0.A 13.57,35.72 16.53,35.72 WIR0.2 16.63,35.72 16.94,35.72 17.86,34.8 21.74,34.8 22.66,35.72 24.08,35.72 WIFI.GPIO0
WFGPIO2  (via drill 0.35)
  Top 0.203: WIL2.A 13.57,32.04 16.53,32.04 WIR2.2 16.53,32.15 v17.55,33.17
  Bottom 0.203: v17.55,33.17 22.96,33.17 24.08,34.29 24.08,38.17 25.1,39.19 WIFI.GPIO2

### Text on the board
tPlace: Edge | IOTECH © 2019 | www.iotech.com.tr | IOTB v1.3 TOP | S/N:
bPlace: IOTECH | IOTB BOT